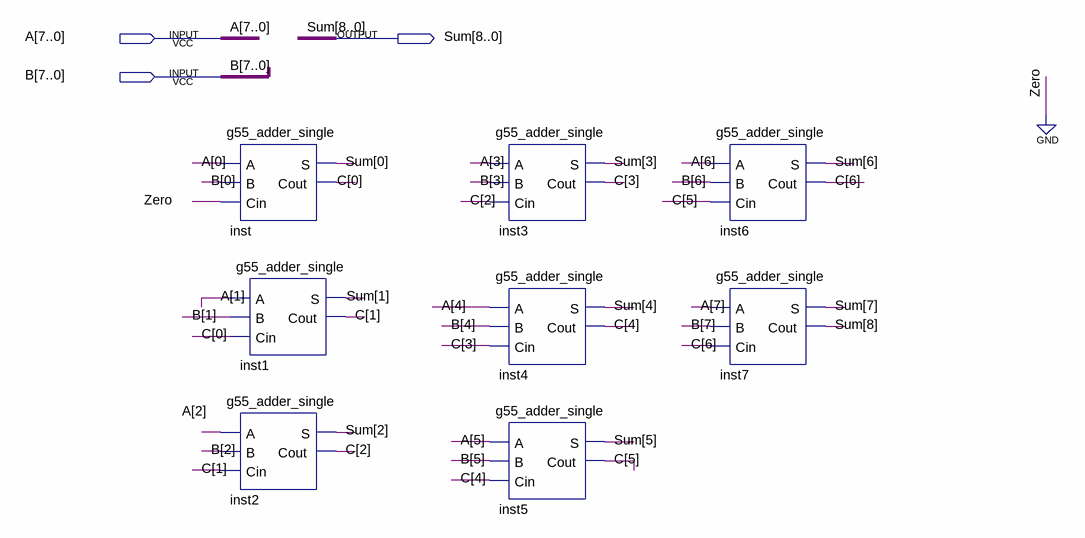
[diagram p0: schematic sheet]
// Quartus schematic g55_adder.bdf as structural Verilog: 8 symbols, 3 pins
module g55_adder (
  input  [7:0] A,
  input  [7:0] B,
  output [8:0] Sum
);

  wire [6:0] C;

  g55_adder_single inst (.A(A[0]), .B(B[0]), .Cin(1'b0), .S(Sum[0]), .Cout(C[0]));
  g55_adder_single inst1 (.A(A[1]), .B(B[1]), .Cin(C[0]), .S(Sum[1]), .Cout(C[1]));
  g55_adder_single inst2 (.A(A[2]), .B(B[2]), .Cin(C[1]), .S(Sum[2]), .Cout(C[2]));
  g55_adder_single inst3 (.A(A[3]), .B(B[3]), .Cin(C[2]), .S(Sum[3]), .Cout(C[3]));
  g55_adder_single inst4 (.A(A[4]), .B(B[4]), .Cin(C[3]), .S(Sum[4]), .Cout(C[4]));
  g55_adder_single inst5 (.A(A[5]), .B(B[5]), .Cin(C[4]), .S(Sum[5]), .Cout(C[5]));
  g55_adder_single inst6 (.A(A[6]), .B(B[6]), .Cin(C[5]), .S(Sum[6]), .Cout(C[6]));
  g55_adder_single inst7 (.A(A[7]), .B(B[7]), .Cin(C[6]), .S(Sum[7]), .Cout(Sum[8]));
endmodule
